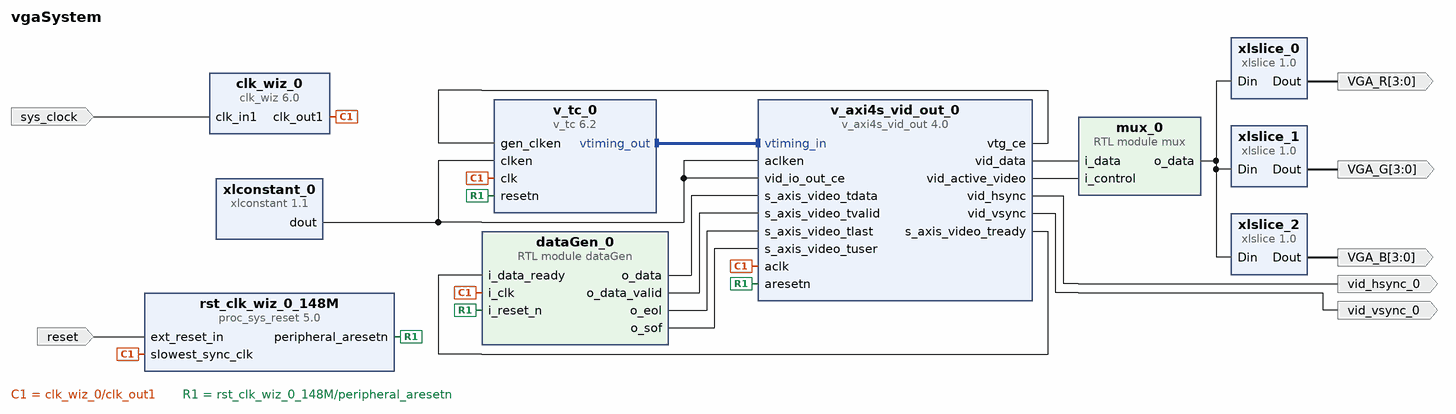
[diagram p0: block diagram of the top level]
# Vivado block design vgaSystem, xc7z020clg484-1, Vivado 2020.2
create_bd_design vgaSystem

create_bd_port -dir I -type clk sys_clock
set_property -dict {CONFIG.FREQ_HZ 100000000 CONFIG.PHASE 0.000} [get_bd_ports sys_clock]
create_bd_port -dir I -type rst reset
set_property -dict {CONFIG.POLARITY ACTIVE_LOW} [get_bd_ports reset]
create_bd_port -dir O vid_hsync_0
create_bd_port -dir O vid_vsync_0
create_bd_port -dir O -from 3 -to 0 VGA_R
create_bd_port -dir O -from 3 -to 0 VGA_G
create_bd_port -dir O -from 3 -to 0 VGA_B

create_bd_cell -type ip -vlnv xilinx.com:ip:clk_wiz:6.0 clk_wiz_0
set_property -dict [list \
  CONFIG.CLKOUT1_JITTER 217.614 \
  CONFIG.CLKOUT1_PHASE_ERROR 245.344 \
  CONFIG.CLKOUT1_REQUESTED_OUT_FREQ 148.5 \
  CONFIG.CLK_IN1_BOARD_INTERFACE sys_clock \
  CONFIG.MMCM_CLKFBOUT_MULT_F 37.125 \
  CONFIG.MMCM_CLKOUT0_DIVIDE_F 6.250 \
  CONFIG.MMCM_DIVCLK_DIVIDE 4 \
  CONFIG.USE_BOARD_FLOW true \
  CONFIG.USE_LOCKED false \
  CONFIG.USE_RESET false \
] [get_bd_cells clk_wiz_0]
create_bd_cell -type ip -vlnv xilinx.com:ip:v_axi4s_vid_out:4.0 v_axi4s_vid_out_0
create_bd_cell -type ip -vlnv xilinx.com:ip:v_tc:6.2 v_tc_0
set_property -dict {CONFIG.HAS_AXI4_LITE false CONFIG.VIDEO_MODE 1080p CONFIG.enable_detection false} [get_bd_cells v_tc_0]
create_bd_cell -type ip -vlnv xilinx.com:ip:proc_sys_reset:5.0 rst_clk_wiz_0_148M
create_bd_cell -type ip -vlnv xilinx.com:ip:xlconstant:1.1 xlconstant_0
create_bd_cell -type ip -vlnv xilinx.com:ip:xlslice:1.0 xlslice_0
set_property -dict {CONFIG.DIN_FROM 3 CONFIG.DIN_WIDTH 24 CONFIG.DOUT_WIDTH 4} [get_bd_cells xlslice_0]
create_bd_cell -type ip -vlnv xilinx.com:ip:xlslice:1.0 xlslice_1
set_property -dict {CONFIG.DIN_FROM 11 CONFIG.DIN_TO 8 CONFIG.DIN_WIDTH 24 CONFIG.DOUT_WIDTH 4} [get_bd_cells xlslice_1]
create_bd_cell -type ip -vlnv xilinx.com:ip:xlslice:1.0 xlslice_2
set_property -dict {CONFIG.DIN_FROM 19 CONFIG.DIN_TO 16 CONFIG.DIN_WIDTH 24 CONFIG.DOUT_WIDTH 4} [get_bd_cells xlslice_2]
create_bd_cell -type module -reference mux mux_0
create_bd_cell -type module -reference dataGen dataGen_0

# ---- connections ----

connect_bd_intf_net [get_bd_intf_pins v_tc_0/vtiming_out] [get_bd_intf_pins v_axi4s_vid_out_0/vtiming_in]
connect_bd_net [get_bd_ports sys_clock] [get_bd_pins clk_wiz_0/clk_in1]
connect_bd_net [get_bd_pins clk_wiz_0/clk_out1] \
  [get_bd_pins v_tc_0/clk] [get_bd_pins rst_clk_wiz_0_148M/slowest_sync_clk] [get_bd_pins v_axi4s_vid_out_0/aclk] \
  [get_bd_pins dataGen_0/i_clk]
connect_bd_net [get_bd_pins rst_clk_wiz_0_148M/peripheral_aresetn] \
  [get_bd_pins v_tc_0/resetn] [get_bd_pins v_axi4s_vid_out_0/aresetn] [get_bd_pins dataGen_0/i_reset_n]
connect_bd_net -net reset_rtl_1 [get_bd_ports reset] [get_bd_pins rst_clk_wiz_0_148M/ext_reset_in]
connect_bd_net [get_bd_pins v_axi4s_vid_out_0/vtg_ce] [get_bd_pins v_tc_0/gen_clken]
connect_bd_net [get_bd_pins xlconstant_0/dout] \
  [get_bd_pins v_tc_0/clken] [get_bd_pins v_axi4s_vid_out_0/aclken] [get_bd_pins v_axi4s_vid_out_0/vid_io_out_ce]
connect_bd_net [get_bd_pins v_axi4s_vid_out_0/vid_hsync] [get_bd_ports vid_hsync_0]
connect_bd_net [get_bd_pins v_axi4s_vid_out_0/vid_vsync] [get_bd_ports vid_vsync_0]
connect_bd_net -net v_axi4s_vid_out_0_vid_data [get_bd_pins mux_0/o_data] \
  [get_bd_pins xlslice_0/Din] [get_bd_pins xlslice_1/Din] [get_bd_pins xlslice_2/Din]
connect_bd_net [get_bd_pins xlslice_0/Dout] [get_bd_ports VGA_R]
connect_bd_net [get_bd_pins xlslice_1/Dout] [get_bd_ports VGA_G]
connect_bd_net [get_bd_pins xlslice_2/Dout] [get_bd_ports VGA_B]
connect_bd_net [get_bd_pins dataGen_0/o_data] [get_bd_pins v_axi4s_vid_out_0/s_axis_video_tdata]
connect_bd_net [get_bd_pins dataGen_0/o_data_valid] [get_bd_pins v_axi4s_vid_out_0/s_axis_video_tvalid]
connect_bd_net [get_bd_pins v_axi4s_vid_out_0/s_axis_video_tready] [get_bd_pins dataGen_0/i_data_ready]
connect_bd_net [get_bd_pins dataGen_0/o_eol] [get_bd_pins v_axi4s_vid_out_0/s_axis_video_tlast]
connect_bd_net [get_bd_pins dataGen_0/o_sof] [get_bd_pins v_axi4s_vid_out_0/s_axis_video_tuser]
connect_bd_net [get_bd_pins v_axi4s_vid_out_0/vid_data] [get_bd_pins mux_0/i_data]
connect_bd_net [get_bd_pins v_axi4s_vid_out_0/vid_active_video] [get_bd_pins mux_0/i_control]

validate_bd_design
save_bd_design
